# EAGLE design drv8837c-breakout (EAGLE 9.6.2)
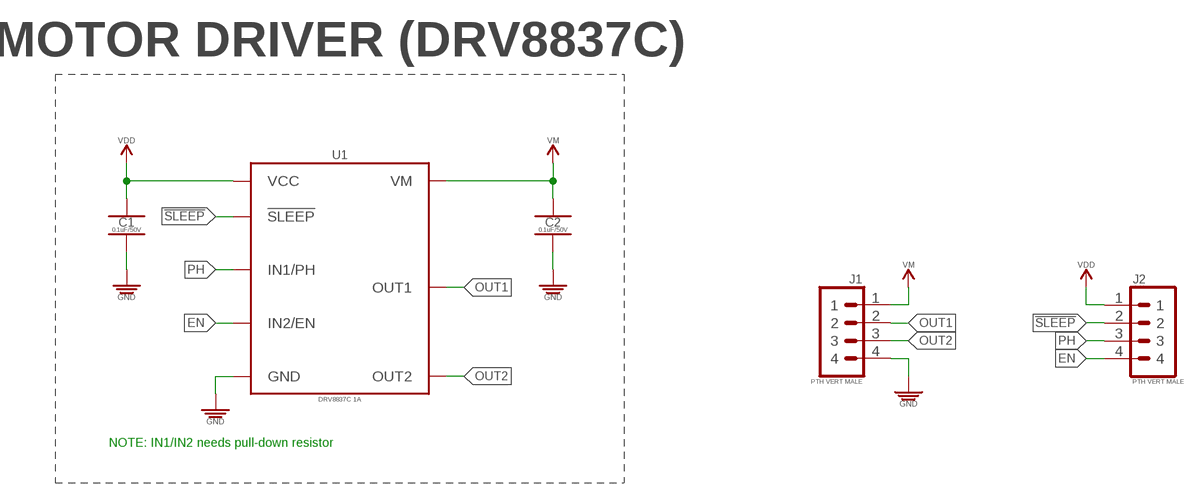
[diagram p0: schematic, sheet 1]

## Parts
C1  0.1uF/50V  0.1UF_SMD-0402_50V-10%  [CAPC1005X55_SMD-0402]
C2  0.1uF/50V  0.1UF_SMD-0402_50V-10%  [CAPC1005X55_SMD-0402]
J1  PTH VERT MALE  1X04_PTH_VERT_MALE_2.54MM  [HDRV4W64P254_1X4_1016X254X838B]
J2  PTH VERT MALE  1X04_PTH_VERT_MALE_2.54MM  [HDRV4W64P254_1X4_1016X254X838B]
U1  DRV8837C 1A  DRV883X_H-BRIDGE_DRV8837C_1A  [WSON-8-PPAD]

## Nets
!SLEEP!: J2.2 U1.7(!SLEEP!)
EN: J2.4 U1.5(IN2/EN)
GND: C1.2 C2.2 J1.4 U1.4(GND) U1.GND U1.P$1(GND) U1.P$2(GND)
OUT1: J1.2 U1.2(OUT1)
OUT2: J1.3 U1.3(OUT2)
PH: J2.3 U1.6(IN1/PH)
VDD: C1.1 J2.1 U1.8(VCC)
VM: C2.1 J1.1 U1.1(VM)

## Notes on the sheet
- MOTOR DRIVER (DRV8837C)
- NOTE: IN1/IN2 needs pull-down resistor

## Library data of the parts
C1 C2 = _capacitors:0.1UF; DATASHEET: https://product.tdk.com/info/en/catalog/datasheets/mlcc_commercial_soft_en.pdf; DIST: Digikey; DISTLINK: https://www.digikey.com/products/en?keywords=445-173610-1-ND; DISTPN: 445-173610-1-ND; MFR: TDK Corporation; MPN: C1005X7R1H104K050BE
J1 J2 = _connectors:1X04; DATASHEET: https://drawings-pdf.s3.amazonaws.com/C10436.pdf; DIST: Digikey; DISTLINK: https://www.digikey.com/products/en?keywords=PEC04SAAN; DISTPN: S1012E-04-ND; MFR: Sullins Connector Solutions; MPN: PEC04SAAN
U1 = _special:DRV883X_H-BRIDGE: DRV883x Series H-Bridge - DRV8837 -> PWM (IN1 & IN2); DRV8838 -> PH IN1/ENA IN2; DATASHEET: http://www.ti.com/lit/ds/symlink/drv8837c.pdf; DIST: Digikey; DISTLINK: https://www.digikey.com/products/en?keywords=296-44747-1-ND; DISTPN: 296-44747-1-ND; MFR: Texas Instruments; MPN: DRV8837CDSGT

## Board
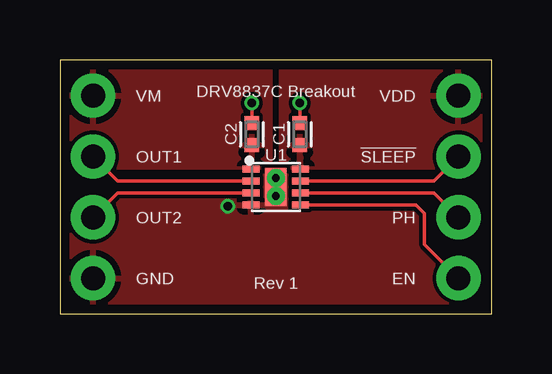
[diagram p1: board, top side]
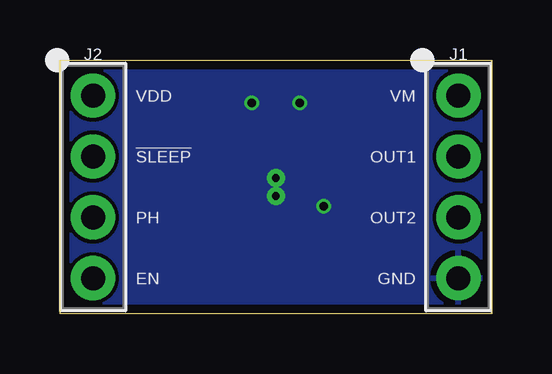
[diagram p2: board, bottom side, seen from below]

Size 18 x 10.6 mm. Coordinates in mm from the lower left corner, seen from the top.
Outline: 0,0 18,0 18,10.6 0,10.6 0,0
Copper layers (1*16): Top 0.035559375mm / dielectric 1.6mm / Bottom 0.035559375mm
Design rules "oshpark-2layer": minimum track width 6mil, minimum drill 10mil, track to track 6mil, track to pad 6mil, pad to pad 6mil, via to via 6mil, smd to smd 6mil, copper to edge 15mil, drill to drill 6mil, minimum pad ring 5mil, minimum via ring 5mil, stop-mask expansion 2.5mil, vias tented up to drill 0mil, thermal gap 10mil

### Footprints (pad centres in the part's own frame; a part is rotated, then mirrored left to right if it is on the bottom)
CAPC1005X55_SMD-0402 = smd 0.585 x 0.612: 1 -0.458,0; 2 0.458,0
HDRV4W64P254_1X4_1016X254X838B = drill 1 pad 1.85: 1 -3.81,0; 2 -1.27,0; 3 1.27,0; 4 3.81,0
WSON-8-PPAD = smd 0.7 x 0.28: 1 -1.035,0.75; 2 -1.035,0.25; 3 -1.035,-0.25; 4 -1.035,-0.75; 5 1.035,-0.75; 6 1.035,-0.25; 7 1.035,0.25; 8 1.035,0.75 | smd 0.9 x 1.6: GND 0,0 | drill 0.33 pad 0.75: P$1 0,-0.38; P$2 0,0.37

### Placement (x,y rotation side)
C1  10,7.5 90 top
C2  8,7.5 90 top
J1  1.38,5.3 270 bottom
J2  16.62,5.3 270 bottom
U1  9,5.3 0 top

### Tracks (layer width: path | path; a pad name or v marks a point on that pad's centre or on a via)
!SLEEP!
  Top 0.152: U1.7 15.6,5.55 J2.2
EN
  Top 0.152: U1.5 14.85,4.55 15.2,4.2 15.2,2.91 J2.4
GND  (via drill 0.35)
  Top 0.152: C2.2 v8,8.8 | C1.2 v10,8.8
  other vias: 7,4.5
  pour Bottom (rank 6): 0,0 18,0 18,10.6 0,10.6
  pour Top (rank 5): 0,0 18,0 18,6.1 0,6.1
OUT1
  Top 0.152: U1.2 2.4,5.55 J1.2
OUT2
  Top 0.152: U1.3 2.4,5.05 J1.3
PH
  Top 0.152: U1.6 15.6,5.05 J2.3
VDD
  pour Top: 9.2,6.1 18,6.1 18,10.6 9.2,10.6
VM
  pour Top: 0,6.1 8.8,6.1 8.8,10.6 0,10.6

### Text on the board
tPlace: VM | DRV8837C Breakout | VDD | OUT1 | !SLEEP! | OUT2 | PH | GND | Rev 1 | EN
bPlace: VM | VDD | OUT1 | !SLEEP! | OUT2 | PH | GND | EN